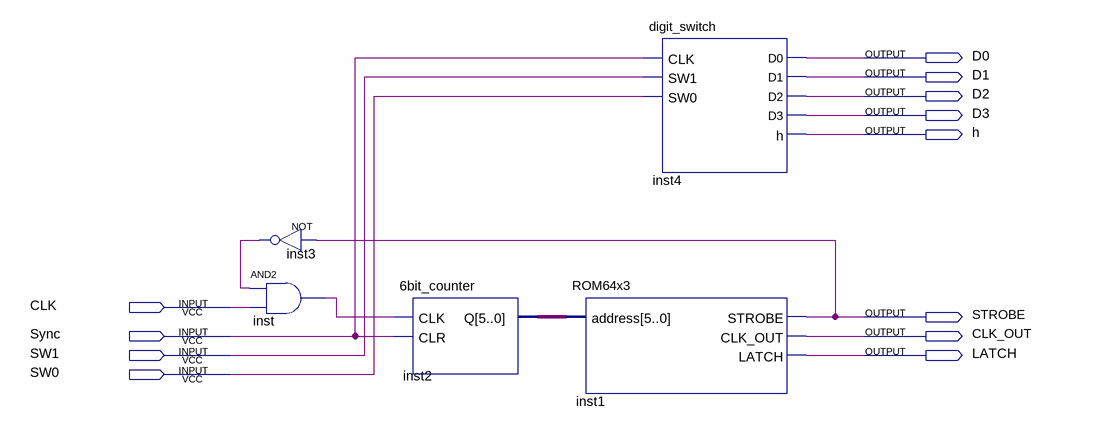
[diagram p0: schematic sheet]
// Quartus schematic control_unit.bdf as structural Verilog: 5 symbols, 12 pins
module control_unit (
  input  CLK,
  input  Sync,
  input  SW1,
  input  SW0,
  output D0,
  output D1,
  output D2,
  output D3,
  output h,
  output STROBE,
  output CLK_OUT,
  output LATCH
);

  wire inst3_out, inst_out;
  wire [5:0] inst2_q;

  not inst3 (inst3_out, STROBE);
  and inst (inst_out, inst3_out, CLK);
  \6bit_counter  inst2 (.CLK(inst_out), .CLR(Sync), .Q(inst2_q));
  ROM64x3 inst1 (.address(inst2_q), .STROBE(STROBE), .CLK_OUT(CLK_OUT), .LATCH(LATCH));
  digit_switch inst4 (.CLK(Sync), .SW1(SW1), .SW0(SW0), .D0(D0), .D1(D1), .D2(D2), .D3(D3), .h(h));
endmodule
